# EAGLE design RGB_Driver (EAGLE 9.4.0)
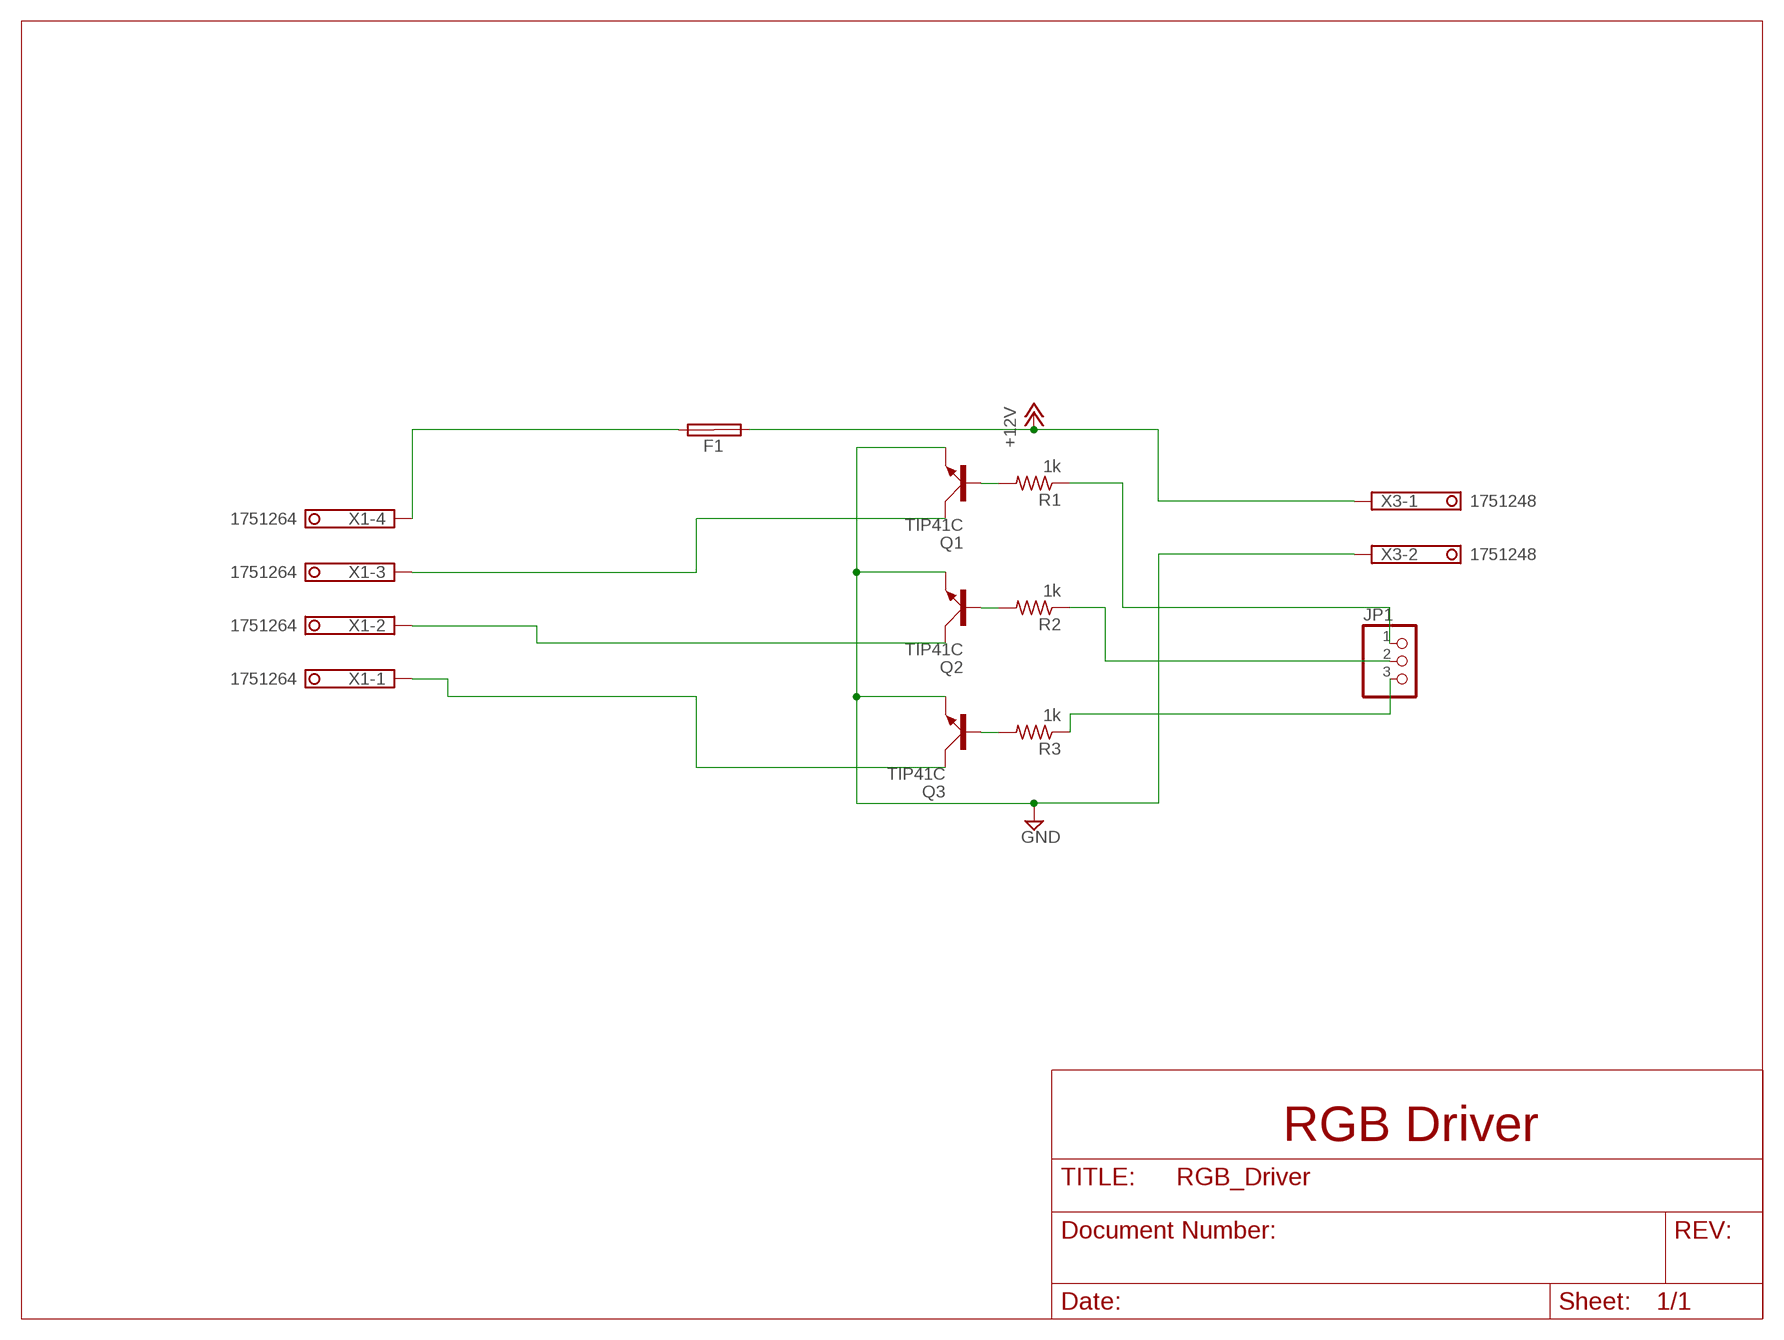
[diagram p0: schematic, sheet 1]

## Parts
F1  SHK20L  [SHK20L]
JP1  PINHD-1X3  [1X03]
Q1  TIP41C  [TO220AV]
Q2  TIP41C  [TO220AV]
Q3  TIP41C  [TO220AV]
R1  1k  R-US_0204/7  [0204/7]
R2  1k  R-US_0204/7  [0204/7]
R3  1k  R-US_0204/7  [0204/7]
X1  1751264  [1751264]
X3  1751248  [1751248]

## Nets
+12V: F1.1A X3.1
GND: Q1.E Q2.E Q3.E X3.2
N$1: Q1.B R1.2
N$2: Q2.B R2.2
N$3: Q3.B R3.2
N$4: Q1.C X1.3
N$5: Q2.C X1.2
N$6: Q3.C X1.1
N$7: JP1.3 R3.1
N$8: JP1.2 R2.1
N$9: JP1.1 R1.1
N$10: F1.2A X1.4
Unconnected: F1.1B F1.2B

## Notes on the sheet
- RGB Driver

## Library data of the parts
F1 = fuse:SHK20L: FUSE HOLDER 5 x 20 mm, SH contact, SHH1 Schukat, E1073 Buerklin; OC_FARNELL: unknown; OC_NEWARK: unknown
JP1 = pinhead:PINHD-1X3: PIN HEADER
Q1-Q3 = transistor-power:TIP41C: NPN TRANSISTOR
R1-R3 = rcl:R-US_: RESISTOR, American symbol; SPICEPREFIX: R
X1 = con-phoenix-350:1751264: MKDS 1/ 4-3,5 Printklemme Nennstrom: 10 A Bemessungsspannung: 160 V Raster: 3,5 mm Polzahl: 4 Montageart: Löten Anschlussart: Schraubanschluss Anschlussrichtung vom Leiter zur Platine: 0° Source: http://eshop.phoenixcontact.com .. 1751264.pdf; MPN: 1751264; OC_FARNELL: unknown; OC_NEWARK: 10R0934
X3 = con-phoenix-350:1751248: MKDS 1/ 2-3,5 Printklemme Nennstrom: 10 A Bemessungsspannung: 160 V Raster: 3,5 mm Polzahl: 2 Montageart: Löten Anschlussart: Schraubanschluss Anschlussrichtung vom Leiter zur Platine: 0° Source: http://eshop.phoenixcontact.com .. 1751248.pdf; OC_FARNELL: unknown; OC_NEWARK: unknown

## Net classes
0 default: width 0.305 mm
1 power internal: width 1.524 mm
2 power external: width 0.587 mm

## Board
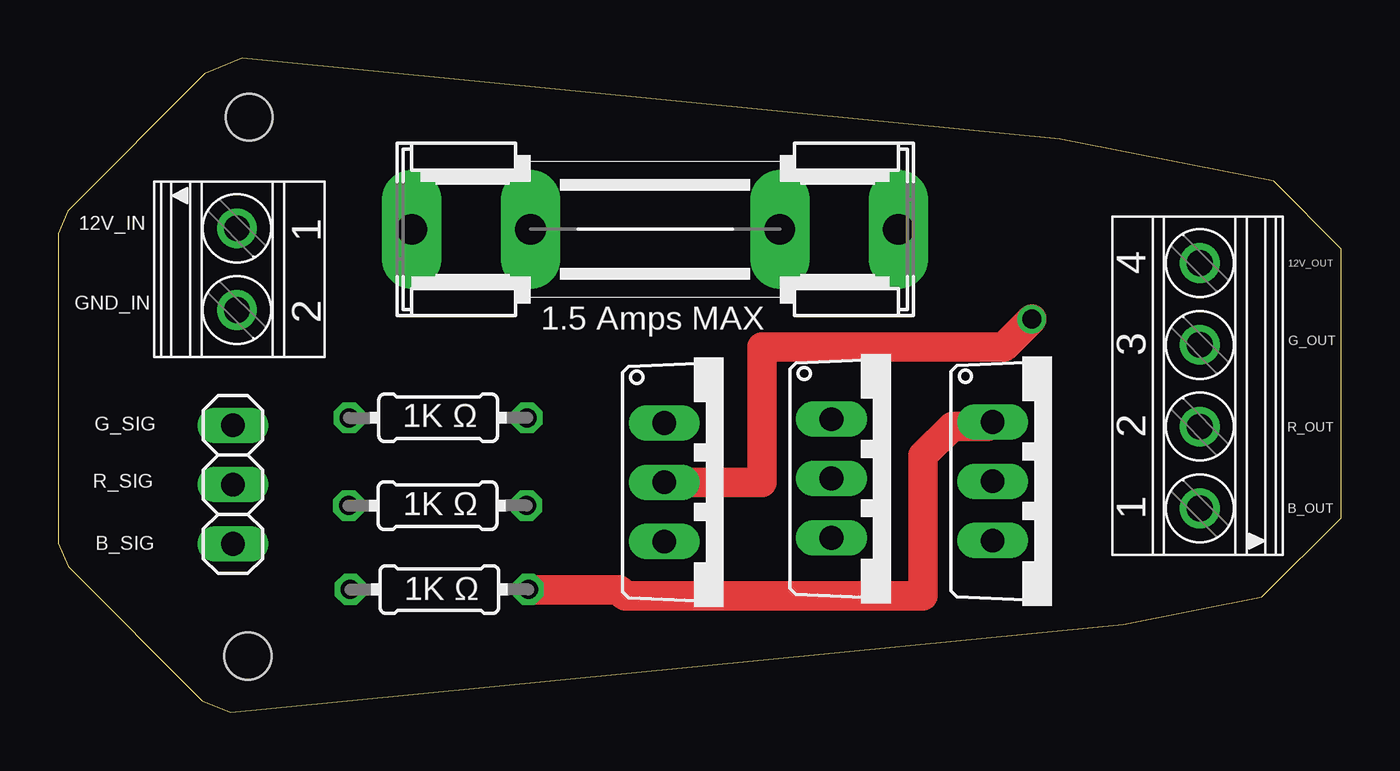
[diagram p1: board, top side]
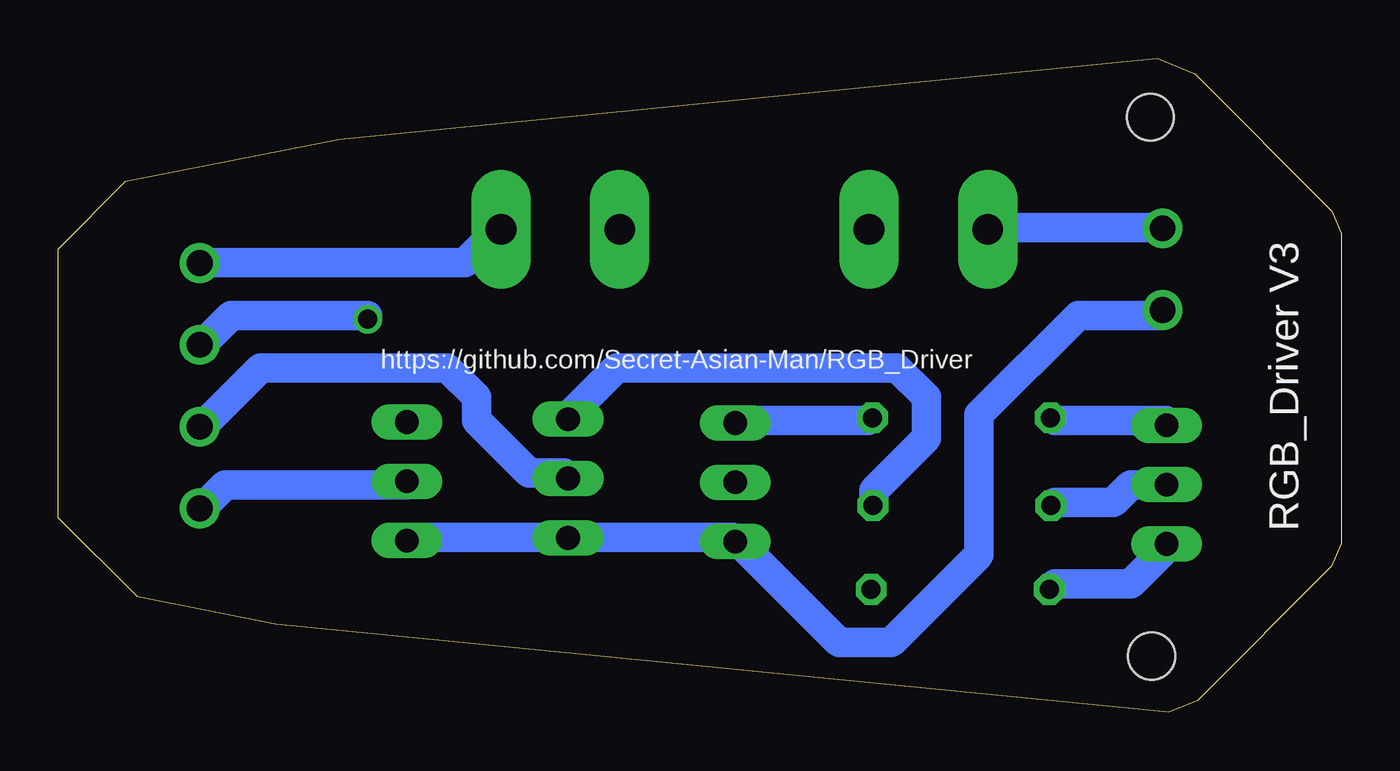
[diagram p2: board, bottom side, seen from below]

Size 54.89 x 28 mm. Coordinates in mm from the lower left corner, seen from the top.
Outline: 7.87,28 42.87,24.55 52.01,22.73 54.9,19.85 54.9,8.34 51.5,4.94 45.57,3.76 7.37,0
Outline: 7.87,28 7.87,28
Outline: 7.87,28 6.26,27.34 0.4,21.47 0,20.51 0,7.24 0.41,6.25 6.16,0.5 7.37,0
Outline: 7.37,0 7.37,0
Copper layers (1*16): Top 0.035mm / dielectric 1.5mm / Bottom 0.035mm
Design rules "default *": minimum track width 50mil, minimum drill 32mil, track to track 32mil, track to pad 32mil, pad to pad 32mil, via to via 32mil, smd to smd 12mil, copper to edge 32mil, drill to drill 32mil, minimum pad ring 10mil, minimum via ring 8mil, stop-mask expansion 6mil, vias tented up to drill 0mil, thermal gap 10mil
Holes 2 mm at 8.17,25.48 8.11,2.41
tKeepout: area 5.9,23.2 to 10.4,27.7; area 6,0.3 to 10.2,4.5

### Footprints (pad centres in the part's own frame; a part is rotated, then mirrored left to right if it is on the bottom)
SHK20L = drill 1.321 pad 2.54 long: 1A -10.414,0; 1B -5.334,0; 2A 10.414,0; 2B 5.334,0
1X03 = drill 1.016 long: 1 -2.54,0; 2 0,0; 3 2.54,0
TO220AV = drill 1.016 long: B -2.54,-2.54; C 0,-2.54; E 2.54,-2.54
0204/7 = drill 0.813 octagon: 1 -3.81,0; 2 3.81,0
1751264 = drill 1.1 pad 1.7: 1 -5.25,-0.1; 2 -1.75,-0.1; 3 1.75,-0.1; 4 5.25,-0.1
1751248 = drill 1.1 pad 1.7: 1 -1.75,-0.1; 2 1.75,-0.1

### Placement (x,y rotation side)
F1  25.54,20.68 0 top
JP1  7.47,9.75 270 top
Q1  28.47,9.86 270 top
Q2  35.62,10.01 270 top
Q3  42.52,9.9 270 top
R1  16.25,12.61 0 top
R2  16.23,8.85 0 top
R3  16.3,5.26 0 top
X1  48.75,13.99 90 top
X3  7.74,18.97 270 top

### Tracks (layer width: path | path; a pad name or v marks a point on that pad's centre or on a via)
+12V
  Bottom 1.27: X3.1 7.75,20.75 15.05,20.75 F1.1A
GND
  Bottom 1.27: Q3.E 39.75,7.5 33.5,7.5 Q2.E 33,7.5 26,7.5 Q1.E 25.5,7 21.5,3 19.25,3 15.5,6.75 15.5,12.75 11.25,17 7.75,17 X3.2
N$1
  Bottom 1.27: R1.2 20.25,12.5 25.75,12.5 Q1.B
N$2
  Bottom 1.27: R2.2 20,9 20,9.5 17.75,11.75 17.75,13.5 19,14.75 31,14.75 33,12.75 Q2.B
N$3
  Top 1.27: R3.2 20.25,5.25 24,5.25 24.25,5 37,5 37,11 38.25,12.25 39.75,12.25 Q3.B
N$4  (via drill 0.81)
  Top 1.27: v41.66,16.84 40.47,15.65 30.11,15.65 30.11,9.86 Q1.C
  Bottom 1.27: v41.66,16.84 41.66,17 47.5,17 48.75,15.75 X1.3
N$5
  Bottom 1.27: Q2.C 33.25,10.25 34.75,10.25 37,12.5 37,13.5 38.25,14.75 46.25,14.75 48.75,12.25 X1.2
N$6
  Bottom 1.27: Q3.C 40,9.75 47.75,9.75 48.75,8.75 X1.1
N$7
  Bottom 1.27: R3.1 12.25,5.5 9,5.5 7.5,7 JP1.3
N$8
  Bottom 1.27: R2.1 12.25,9 9.75,9 9,9.75 7.5,9.75 JP1.2
N$9
  Bottom 1.27: R1.1 12.25,12.5 7.5,12.5 JP1.1
N$10
  Bottom 1.27: X1.4 48.75,19.25 37.5,19.25 36.08,20.67 F1.2A

### Text on the board
tNames: 12V_IN | 12V_OUT | GND_IN | 1.5 Amps MAX | G_OUT | G_SIG | 1K Ω | R_OUT | R_SIG | B_OUT | 1K Ω | B_SIG | 1K Ω
bNames: https://github.com/Secret-Asian-Man/RGB_Driver | RGB_Driver V3